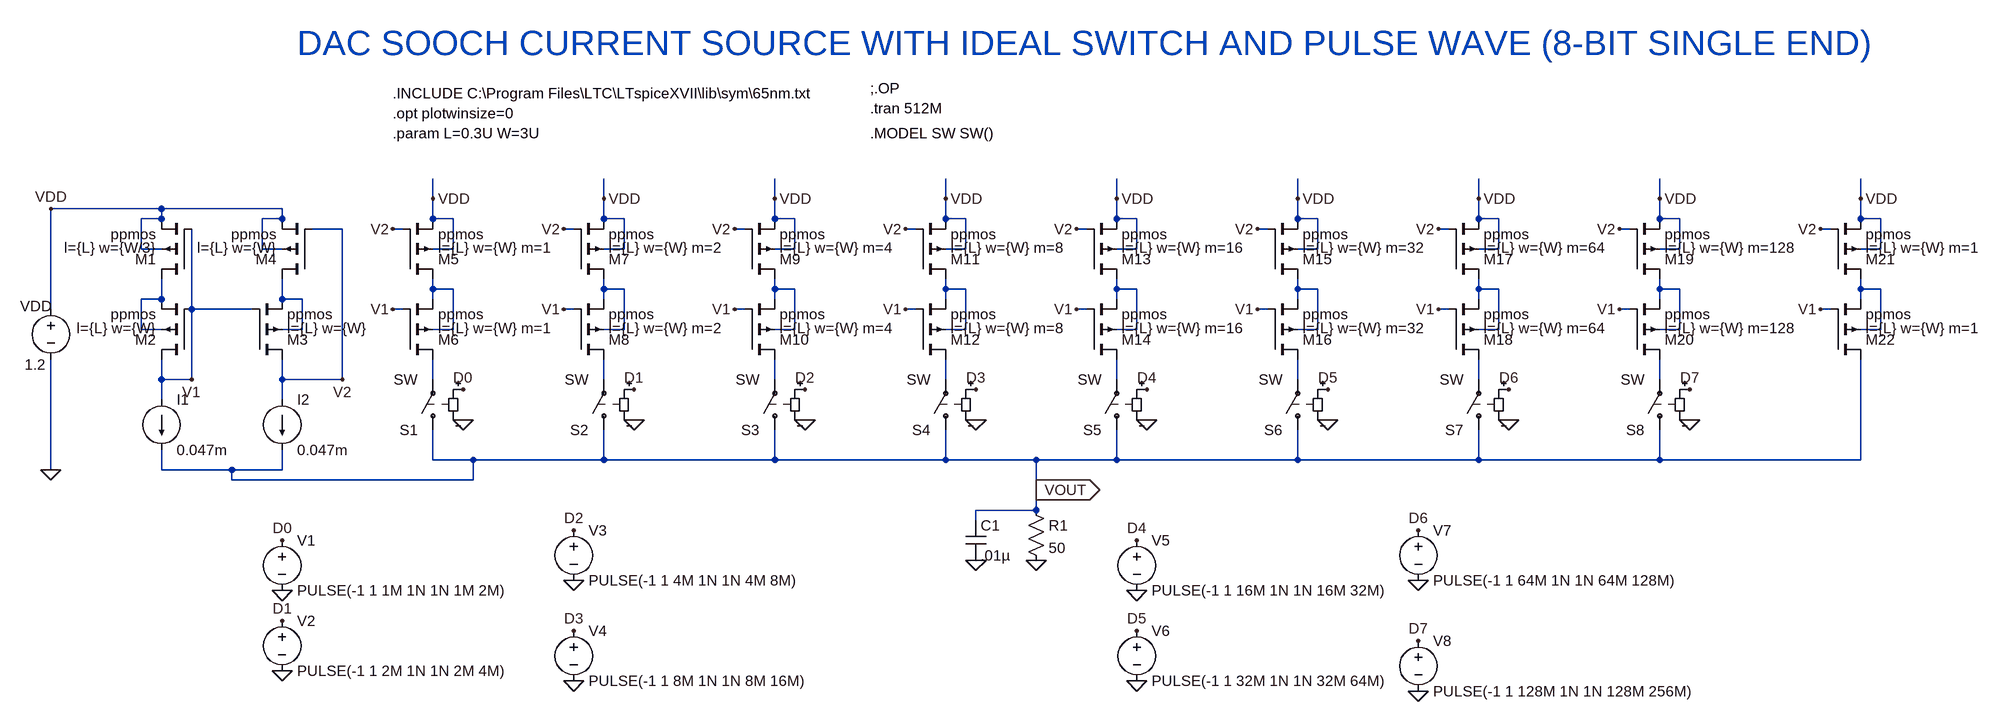
[diagram p0: schematic 102DAC_SOOCH_PULSE.asc]
102DAC_SOOCH_PULSE.asc, the LTspice schematic file:
Version 4
SHEET 1 1932 680
WIRE -640 -352 -640 -384
WIRE -368 -352 -368 -384
WIRE -96 -352 -96 -384
WIRE 176 -352 176 -384
WIRE 448 -352 448 -384
WIRE 736 -352 736 -384
WIRE 1024 -352 1024 -384
WIRE 1312 -352 1312 -384
WIRE 1632 -352 1632 -384
WIRE -1072 -336 -1248 -336
WIRE -880 -336 -1072 -336
WIRE -1072 -320 -1072 -336
WIRE -1072 -320 -1104 -320
WIRE -880 -320 -880 -336
WIRE -880 -320 -912 -320
WIRE -640 -320 -640 -352
WIRE -608 -320 -640 -320
WIRE -368 -320 -368 -352
WIRE -336 -320 -368 -320
WIRE -96 -320 -96 -352
WIRE -64 -320 -96 -320
WIRE 176 -320 176 -352
WIRE 208 -320 176 -320
WIRE 448 -320 448 -352
WIRE 480 -320 448 -320
WIRE 736 -320 736 -352
WIRE 768 -320 736 -320
WIRE 1024 -320 1024 -352
WIRE 1056 -320 1024 -320
WIRE 1312 -320 1312 -352
WIRE 1344 -320 1312 -320
WIRE 1632 -320 1632 -352
WIRE 1664 -320 1632 -320
WIRE -784 -304 -832 -304
WIRE -688 -304 -704 -304
WIRE -416 -304 -432 -304
WIRE -144 -304 -160 -304
WIRE 128 -304 112 -304
WIRE 400 -304 384 -304
WIRE 688 -304 672 -304
WIRE 976 -304 960 -304
WIRE 1264 -304 1248 -304
WIRE 1584 -304 1568 -304
WIRE -1104 -272 -1104 -320
WIRE -1072 -272 -1104 -272
WIRE -912 -272 -912 -320
WIRE -880 -272 -912 -272
WIRE -608 -272 -608 -320
WIRE -608 -272 -640 -272
WIRE -336 -272 -336 -320
WIRE -336 -272 -368 -272
WIRE -64 -272 -64 -320
WIRE -64 -272 -96 -272
WIRE 208 -272 208 -320
WIRE 208 -272 176 -272
WIRE 480 -272 480 -320
WIRE 480 -272 448 -272
WIRE 768 -272 768 -320
WIRE 768 -272 736 -272
WIRE 1056 -272 1056 -320
WIRE 1056 -272 1024 -272
WIRE 1344 -272 1344 -320
WIRE 1344 -272 1312 -272
WIRE 1664 -272 1664 -320
WIRE 1664 -272 1632 -272
WIRE -640 -208 -640 -224
WIRE -608 -208 -640 -208
WIRE -368 -208 -368 -224
WIRE -336 -208 -368 -208
WIRE -96 -208 -96 -224
WIRE -64 -208 -96 -208
WIRE 176 -208 176 -224
WIRE 208 -208 176 -208
WIRE 448 -208 448 -224
WIRE 480 -208 448 -208
WIRE 736 -208 736 -224
WIRE 768 -208 736 -208
WIRE 1024 -208 1024 -224
WIRE 1056 -208 1024 -208
WIRE 1312 -208 1312 -224
WIRE 1344 -208 1312 -208
WIRE 1632 -208 1632 -224
WIRE 1664 -208 1632 -208
WIRE -1072 -192 -1072 -224
WIRE -1072 -192 -1104 -192
WIRE -880 -192 -880 -224
WIRE -848 -192 -880 -192
WIRE -640 -192 -640 -208
WIRE -368 -192 -368 -208
WIRE -96 -192 -96 -208
WIRE 176 -192 176 -208
WIRE 448 -192 448 -208
WIRE 736 -192 736 -208
WIRE 1024 -192 1024 -208
WIRE 1312 -192 1312 -208
WIRE 1632 -192 1632 -208
WIRE -1248 -176 -1248 -336
WIRE -1024 -176 -1024 -304
WIRE -928 -176 -1024 -176
WIRE -688 -176 -704 -176
WIRE -416 -176 -432 -176
WIRE -144 -176 -160 -176
WIRE 128 -176 112 -176
WIRE 400 -176 384 -176
WIRE 688 -176 672 -176
WIRE 976 -176 960 -176
WIRE 1264 -176 1248 -176
WIRE 1584 -176 1568 -176
WIRE -1104 -144 -1104 -192
WIRE -1072 -144 -1104 -144
WIRE -848 -144 -848 -192
WIRE -848 -144 -880 -144
WIRE -608 -144 -608 -208
WIRE -608 -144 -640 -144
WIRE -336 -144 -336 -208
WIRE -336 -144 -368 -144
WIRE -64 -144 -64 -208
WIRE -64 -144 -96 -144
WIRE 208 -144 208 -208
WIRE 208 -144 176 -144
WIRE 480 -144 480 -208
WIRE 480 -144 448 -144
WIRE 768 -144 768 -208
WIRE 768 -144 736 -144
WIRE 1056 -144 1056 -208
WIRE 1056 -144 1024 -144
WIRE 1344 -144 1344 -208
WIRE 1344 -144 1312 -144
WIRE 1664 -144 1664 -208
WIRE 1664 -144 1632 -144
WIRE -1072 -64 -1072 -96
WIRE -1024 -64 -1024 -176
WIRE -1024 -64 -1072 -64
WIRE -880 -64 -880 -96
WIRE -784 -64 -784 -304
WIRE -784 -64 -880 -64
WIRE -640 -64 -640 -96
WIRE -368 -64 -368 -96
WIRE -96 -64 -96 -96
WIRE 176 -64 176 -96
WIRE 448 -64 448 -96
WIRE 736 -64 736 -96
WIRE 1024 -64 1024 -96
WIRE 1312 -64 1312 -96
WIRE -1072 -32 -1072 -64
WIRE -880 -32 -880 -64
WIRE -640 64 -640 16
WIRE -576 64 -640 64
WIRE -368 64 -368 16
WIRE -368 64 -576 64
WIRE -96 64 -96 16
WIRE -96 64 -368 64
WIRE 176 64 176 16
WIRE 176 64 -96 64
WIRE 320 64 176 64
WIRE 448 64 448 16
WIRE 448 64 320 64
WIRE 736 64 736 16
WIRE 736 64 448 64
WIRE 1024 64 1024 16
WIRE 1024 64 736 64
WIRE 1312 64 1312 16
WIRE 1312 64 1024 64
WIRE 1632 64 1632 -96
WIRE 1632 64 1312 64
WIRE -1248 80 -1248 -96
WIRE -1072 80 -1072 48
WIRE -960 80 -1072 80
WIRE -880 80 -880 48
WIRE -880 80 -960 80
WIRE -960 96 -960 80
WIRE -576 96 -576 64
WIRE -576 96 -960 96
WIRE 320 112 320 64
WIRE 320 144 320 112
WIRE 320 144 224 144
WIRE 224 160 224 144
FLAG -1024 -64 V1
FLAG -704 -176 V1
FLAG -784 -64 V2
FLAG -704 -304 V2
FLAG -640 -352 VDD
FLAG -1248 -336 VDD
FLAG -432 -176 V1
FLAG -432 -304 V2
FLAG -368 -352 VDD
FLAG -160 -176 V1
FLAG -160 -304 V2
FLAG -96 -352 VDD
FLAG 112 -176 V1
FLAG 112 -304 V2
FLAG 176 -352 VDD
FLAG 384 -176 V1
FLAG 384 -304 V2
FLAG 448 -352 VDD
FLAG 672 -176 V1
FLAG 672 -304 V2
FLAG 736 -352 VDD
FLAG 960 -176 V1
FLAG 960 -304 V2
FLAG 1024 -352 VDD
FLAG 1248 -176 V1
FLAG 1248 -304 V2
FLAG 1312 -352 VDD
FLAG -592 0 0
FLAG -320 0 0
FLAG -48 0 0
FLAG 224 0 0
FLAG 496 0 0
FLAG 784 0 0
FLAG 1072 0 0
FLAG 1360 0 0
FLAG 320 224 0
FLAG -592 -48 D0
FLAG -320 -48 D1
FLAG -48 -48 D2
FLAG 224 -48 D3
FLAG 496 -48 D4
FLAG 784 -48 D5
FLAG 1072 -48 D6
FLAG 1360 -48 D7
FLAG 320 112 VOUT
IOPIN 320 112 Out
FLAG 224 224 0
FLAG -880 272 0
FLAG -880 400 0
FLAG -416 256 0
FLAG -416 416 0
FLAG -880 192 D0
FLAG -880 320 D1
FLAG -416 176 D2
FLAG -416 336 D3
FLAG 480 272 0
FLAG 480 416 0
FLAG 928 256 0
FLAG 928 432 0
FLAG 480 192 D4
FLAG 480 336 D5
FLAG 928 176 D6
FLAG 928 352 D7
FLAG -1248 80 0
FLAG 1568 -176 V1
FLAG 1568 -304 V2
FLAG 1632 -352 VDD
SYMBOL pmos4 -1024 -224 R180
WINDOW 123 56 50 Left 2
SYMATTR Value2 l={L} w={W/3}
SYMATTR InstName M1
SYMATTR Value ppmos
SYMBOL pmos4 -1024 -96 R180
WINDOW 123 56 50 Left 2
SYMATTR Value2 l={L} w={W}
SYMATTR InstName M2
SYMATTR Value ppmos
SYMBOL current -1072 -32 R0
WINDOW 123 0 0 Left 0
WINDOW 39 0 0 Left 0
SYMATTR InstName I1
SYMATTR Value 0.047m
SYMBOL pmos4 -928 -96 M180
WINDOW 123 56 50 Left 2
SYMATTR Value2 l={L} w={W}
SYMATTR InstName M3
SYMATTR Value ppmos
SYMBOL pmos4 -832 -224 R180
WINDOW 123 56 50 Left 2
SYMATTR Value2 l={L} w={W}
SYMATTR InstName M4
SYMATTR Value ppmos
SYMBOL current -880 -32 R0
WINDOW 123 0 0 Left 0
WINDOW 39 0 0 Left 0
SYMATTR InstName I2
SYMATTR Value 0.047m
SYMBOL pmos4 -688 -224 M180
WINDOW 123 56 50 Left 2
SYMATTR Value2 l={L} w={W} m=1
SYMATTR InstName M5
SYMATTR Value ppmos
SYMBOL pmos4 -688 -96 M180
WINDOW 123 56 50 Left 2
SYMATTR Value2 l={L} w={W} m=1
SYMATTR InstName M6
SYMATTR Value ppmos
SYMBOL voltage -1248 -192 R0
WINDOW 123 0 0 Left 0
WINDOW 39 0 0 Left 0
WINDOW 0 -49 11 Left 2
WINDOW 3 -42 104 Left 2
SYMATTR InstName VDD
SYMATTR Value 1.2
SYMBOL pmos4 -416 -224 M180
WINDOW 123 56 50 Left 2
SYMATTR Value2 l={L} w={W} m=2
SYMATTR InstName M7
SYMATTR Value ppmos
SYMBOL pmos4 -416 -96 M180
WINDOW 123 56 50 Left 2
SYMATTR Value2 l={L} w={W} m=2
SYMATTR InstName M8
SYMATTR Value ppmos
SYMBOL pmos4 -144 -224 M180
WINDOW 123 56 50 Left 2
SYMATTR Value2 l={L} w={W} m=4
SYMATTR InstName M9
SYMATTR Value ppmos
SYMBOL pmos4 -144 -96 M180
WINDOW 123 56 50 Left 2
SYMATTR Value2 l={L} w={W} m=4
SYMATTR InstName M10
SYMATTR Value ppmos
SYMBOL pmos4 128 -224 M180
WINDOW 123 56 50 Left 2
SYMATTR Value2 l={L} w={W} m=8
SYMATTR InstName M11
SYMATTR Value ppmos
SYMBOL pmos4 128 -96 M180
WINDOW 123 56 50 Left 2
SYMATTR Value2 l={L} w={W} m=8
SYMATTR InstName M12
SYMATTR Value ppmos
SYMBOL pmos4 400 -224 M180
WINDOW 123 56 50 Left 2
SYMATTR Value2 l={L} w={W} m=16
SYMATTR InstName M13
SYMATTR Value ppmos
SYMBOL pmos4 400 -96 M180
WINDOW 123 56 50 Left 2
SYMATTR Value2 l={L} w={W} m=16
SYMATTR InstName M14
SYMATTR Value ppmos
SYMBOL pmos4 688 -224 M180
WINDOW 123 56 50 Left 2
SYMATTR Value2 l={L} w={W} m=32
SYMATTR InstName M15
SYMATTR Value ppmos
SYMBOL pmos4 688 -96 M180
WINDOW 123 56 50 Left 2
SYMATTR Value2 l={L} w={W} m=32
SYMATTR InstName M16
SYMATTR Value ppmos
SYMBOL pmos4 976 -224 M180
WINDOW 123 56 50 Left 2
SYMATTR Value2 l={L} w={W} m=64
SYMATTR InstName M17
SYMATTR Value ppmos
SYMBOL pmos4 976 -96 M180
WINDOW 123 56 50 Left 2
SYMATTR Value2 l={L} w={W} m=64
SYMATTR InstName M18
SYMATTR Value ppmos
SYMBOL pmos4 1264 -224 M180
WINDOW 123 56 50 Left 2
SYMATTR Value2 l={L} w={W} m=128
SYMATTR InstName M19
SYMATTR Value ppmos
SYMBOL pmos4 1264 -96 M180
WINDOW 123 56 50 Left 2
SYMATTR Value2 l={L} w={W} m=128
SYMATTR InstName M20
SYMATTR Value ppmos
SYMBOL res 304 128 R0
SYMATTR InstName R1
SYMATTR Value 50
SYMBOL sw -640 32 R180
SYMATTR InstName S1
SYMBOL sw -368 32 R180
SYMATTR InstName S2
SYMBOL sw -96 32 R180
SYMATTR InstName S3
SYMBOL sw 176 32 R180
SYMATTR InstName S4
SYMBOL sw 448 32 R180
SYMATTR InstName S5
SYMBOL sw 736 32 R180
SYMATTR InstName S6
SYMBOL sw 1024 32 R180
SYMATTR InstName S7
SYMBOL sw 1312 32 R180
SYMATTR InstName S8
SYMBOL cap 208 160 R0
SYMATTR InstName C1
SYMATTR Value .01µ
SYMBOL voltage -880 176 R0
WINDOW 123 0 0 Left 0
WINDOW 39 0 0 Left 0
SYMATTR InstName V1
SYMATTR Value PULSE(-1 1 1M 1N 1N 1M 2M)
SYMBOL voltage -880 304 R0
SYMATTR InstName V2
SYMATTR Value PULSE(-1 1 2M 1N 1N 2M 4M)
SYMBOL voltage -416 160 R0
SYMATTR InstName V3
SYMATTR Value PULSE(-1 1 4M 1N 1N 4M 8M)
SYMBOL voltage -416 320 R0
SYMATTR InstName V4
SYMATTR Value PULSE(-1 1 8M 1N 1N 8M 16M)
SYMBOL voltage 480 176 R0
SYMATTR InstName V5
SYMATTR Value PULSE(-1 1 16M 1N 1N 16M 32M)
SYMBOL voltage 480 320 R0
SYMATTR InstName V6
SYMATTR Value PULSE(-1 1 32M 1N 1N 32M 64M)
SYMBOL voltage 928 160 R0
SYMATTR InstName V7
SYMATTR Value PULSE(-1 1 64M 1N 1N 64M 128M)
SYMBOL voltage 928 336 R0
SYMATTR InstName V8
SYMATTR Value PULSE(-1 1 128M 1N 1N 128M 256M)
SYMBOL pmos4 1584 -224 M180
WINDOW 123 56 50 Left 2
SYMATTR Value2 l={L} w={W} m=1
SYMATTR InstName M21
SYMATTR Value ppmos
SYMBOL pmos4 1584 -96 M180
WINDOW 123 56 50 Left 2
SYMATTR Value2 l={L} w={W} m=1
SYMATTR InstName M22
SYMATTR Value ppmos
TEXT -704 -520 Left 2 !.INCLUDE C:\\Program Files\\LTC\\LTspiceXVII\\lib\\sym\\65nm.txt
TEXT -704 -488 Left 2 !.opt plotwinsize=0
TEXT 56 -528 Left 2 !;.OP
TEXT -704 -456 Left 2 !.param L=0.3U W=3U
TEXT 56 -496 Left 2 !.tran 512M
TEXT 56 -456 Left 2 !.MODEL SW SW()
TEXT -856 -600 Left 5 ;DAC SOOCH CURRENT SOURCE WITH IDEAL SWITCH AND PULSE WAVE (8-BIT SINGLE END)

The netlist it stands for:
* 102DAC_SOOCH_PULSE.asc
M1 N010 V1 VDD VDD ppmos l={L} w={W/3}
M2 V1 V1 N010 N010 ppmos l={L} w={W}
I1 V1 VOUT 0.047m
M3 V2 V1 N011 N011 ppmos l={L} w={W}
M4 N011 V2 VDD VDD ppmos l={L} w={W}
I2 V2 VOUT 0.047m
M5 N001 V2 VDD VDD ppmos l={L} w={W} m=1
M6 N012 V1 N001 N001 ppmos l={L} w={W} m=1
VDD VDD 0 1.2
M7 N002 V2 VDD VDD ppmos l={L} w={W} m=2
M8 N013 V1 N002 N002 ppmos l={L} w={W} m=2
M9 N003 V2 VDD VDD ppmos l={L} w={W} m=4
M10 N014 V1 N003 N003 ppmos l={L} w={W} m=4
M11 N004 V2 VDD VDD ppmos l={L} w={W} m=8
M12 N015 V1 N004 N004 ppmos l={L} w={W} m=8
M13 N005 V2 VDD VDD ppmos l={L} w={W} m=16
M14 N016 V1 N005 N005 ppmos l={L} w={W} m=16
M15 N006 V2 VDD VDD ppmos l={L} w={W} m=32
M16 N017 V1 N006 N006 ppmos l={L} w={W} m=32
M17 N007 V2 VDD VDD ppmos l={L} w={W} m=64
M18 N018 V1 N007 N007 ppmos l={L} w={W} m=64
M19 N008 V2 VDD VDD ppmos l={L} w={W} m=128
M20 N019 V1 N008 N008 ppmos l={L} w={W} m=128
R1 VOUT 0 50
S1 VOUT N012 D0 0 SW
S2 VOUT N013 D1 0 SW
S3 VOUT N014 D2 0 SW
S4 VOUT N015 D3 0 SW
S5 VOUT N016 D4 0 SW
S6 VOUT N017 D5 0 SW
S7 VOUT N018 D6 0 SW
S8 VOUT N019 D7 0 SW
C1 VOUT 0 .01µ
V1 D0 0 PULSE(-1 1 1M 1N 1N 1M 2M)
V2 D1 0 PULSE(-1 1 2M 1N 1N 2M 4M)
V3 D2 0 PULSE(-1 1 4M 1N 1N 4M 8M)
V4 D3 0 PULSE(-1 1 8M 1N 1N 8M 16M)
V5 D4 0 PULSE(-1 1 16M 1N 1N 16M 32M)
V6 D5 0 PULSE(-1 1 32M 1N 1N 32M 64M)
V7 D6 0 PULSE(-1 1 64M 1N 1N 64M 128M)
V8 D7 0 PULSE(-1 1 128M 1N 1N 128M 256M)
M21 N009 V2 VDD VDD ppmos l={L} w={W} m=1
M22 VOUT V1 N009 N009 ppmos l={L} w={W} m=1
.model NMOS NMOS
.model PMOS PMOS
.lib standard.mos
.INCLUDE C:\Program Files\LTC\LTspiceXVII\lib\sym\65nm.txt
.opt plotwinsize=0
;.OP
.param L=0.3U W=3U
.tran 512M
.MODEL SW SW()
* DAC SOOCH CURRENT SOURCE WITH IDEAL SWITCH AND PULSE WAVE (8-BIT SINGLE END)
.backanno
.end